# EAGLE design tick-display-mk-3.1 (EAGLE 6.5.0)
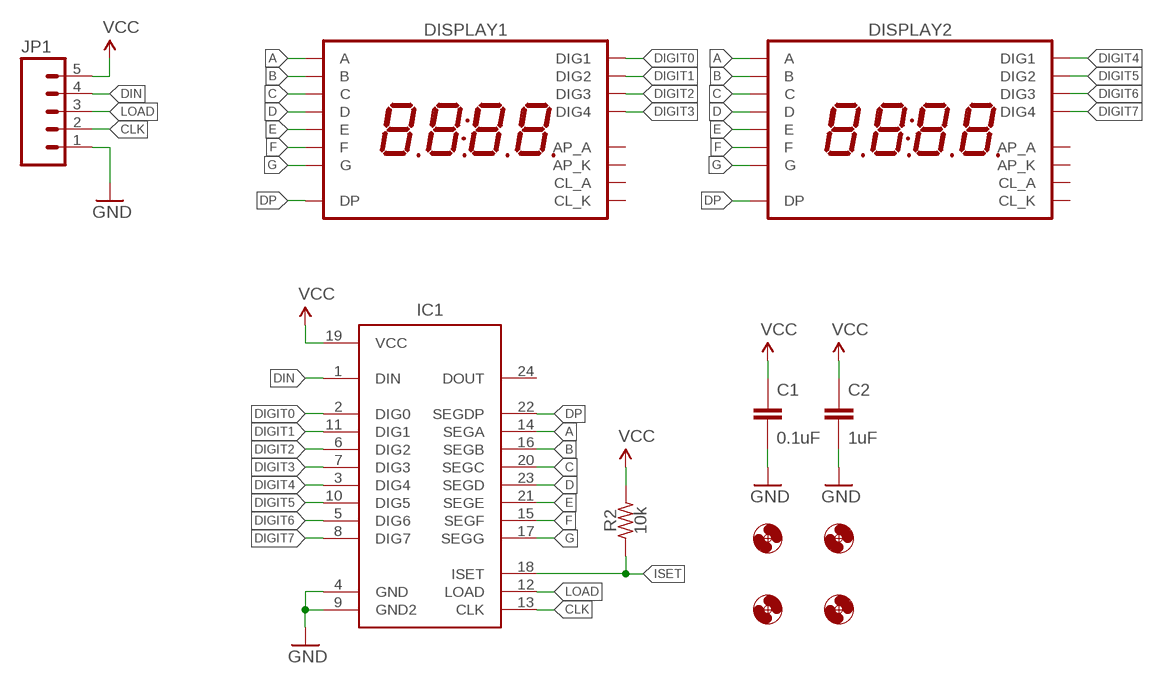
[diagram p0: schematic, sheet 1]

## Parts
C1  0.1uF  CAPACITOR-CERAMIC025-024X044  [C025-024X044]
C2  1uF  CAPACITOR-CERAMIC025-024X044  [C025-024X044]
DISPLAY1  7SEG_4DIGIT_10MM  [7SEG_4DIG_10MM]
DISPLAY2  7SEG_4DIGIT_10MM  [7SEG_4DIG_10MM]
H1  HOLE#2  [HOLE-#2]
H2  HOLE#2  [HOLE-#2]
H3  HOLE#2  [HOLE-#2]
H4  HOLE#2  [HOLE-#2]
IC1  MAX7219CWG  MAX7219SOIC-W  [SO24W]
JP1  M05PTH  [1X05]
R2  10k  RESISTORPTH-AXIAL-5.08MM  [RESISTOR-AXIAL-PTH-5.08MM]

## Nets
A: DISPLAY1.14(A) DISPLAY2.14(A) IC1.14(SEGA)
B: DISPLAY1.16(B) DISPLAY2.16(B) IC1.16(SEGB)
C: DISPLAY1.13(C) DISPLAY2.13(C) IC1.20(SEGC)
CLK: IC1.13(CLK) JP1.2
D: DISPLAY1.3(D) DISPLAY2.3(D) IC1.23(SEGD)
DIGIT0: DISPLAY1.1(DIG1) IC1.2(DIG0)
DIGIT1: DISPLAY1.2(DIG2) IC1.11(DIG1)
DIGIT2: DISPLAY1.6(DIG3) IC1.6(DIG2)
DIGIT3: DISPLAY1.8(DIG4) IC1.7(DIG3)
DIGIT4: DISPLAY2.1(DIG1) IC1.3(DIG4)
DIGIT5: DISPLAY2.2(DIG2) IC1.10(DIG5)
DIGIT6: DISPLAY2.6(DIG3) IC1.5(DIG6)
DIGIT7: DISPLAY2.8(DIG4) IC1.8(DIG7)
DIN: IC1.1(DIN) JP1.4
DP: DISPLAY1.7(DP) DISPLAY2.7(DP) IC1.22(SEGDP)
E: DISPLAY1.5(E) DISPLAY2.5(E) IC1.21(SEGE)
F: DISPLAY1.11(F) DISPLAY2.11(F) IC1.15(SEGF)
G: DISPLAY1.15(G) DISPLAY2.15(G) IC1.17(SEGG)
GND: C1.2 C2.2 IC1.4(GND) IC1.9(GND2) JP1.1
ISET: IC1.18(ISET) R2.P$1
LOAD: IC1.12(LOAD) JP1.3
VCC: C1.1 C2.1 IC1.19(VCC) JP1.5 R2.P$2
Unconnected: DISPLAY1.4(CL_A) DISPLAY1.9(AP_K) DISPLAY1.10(AP_A) DISPLAY1.12(CL_K) DISPLAY2.4(CL_A) DISPLAY2.9(AP_K) DISPLAY2.10(AP_A) DISPLAY2.12(CL_K) IC1.24(DOUT)

## Library data of the parts
C1 C2 = A_butts:CAPACITOR-CERAMIC: CAPACITOR, European symbol
DISPLAY1 DISPLAY2 = A_butts:7SEG_4DIGIT_10MM
H1-H4 = A_butts:HOLE: MOUNTING HOLE with drill center marker
IC1 = A_butts:MAX7219: 8-digit, 8-segment LED display driver, serial input
JP1 = A_butts:M05: Header 5 Standard 5-pin 0.1" header. Use with straight break away headers (SKU : PRT-00116), right angle break away headers (PRT-00553), swiss pins (PRT-00743), machine pins (PRT-00117), and female headers (PRT-00115). Molex polarized connector foot print use with SKU : PRT-08230 with associated crimp pins and housings.
R2 = A_butts:RESISTOR: RESISTOR, American symbol

## Board
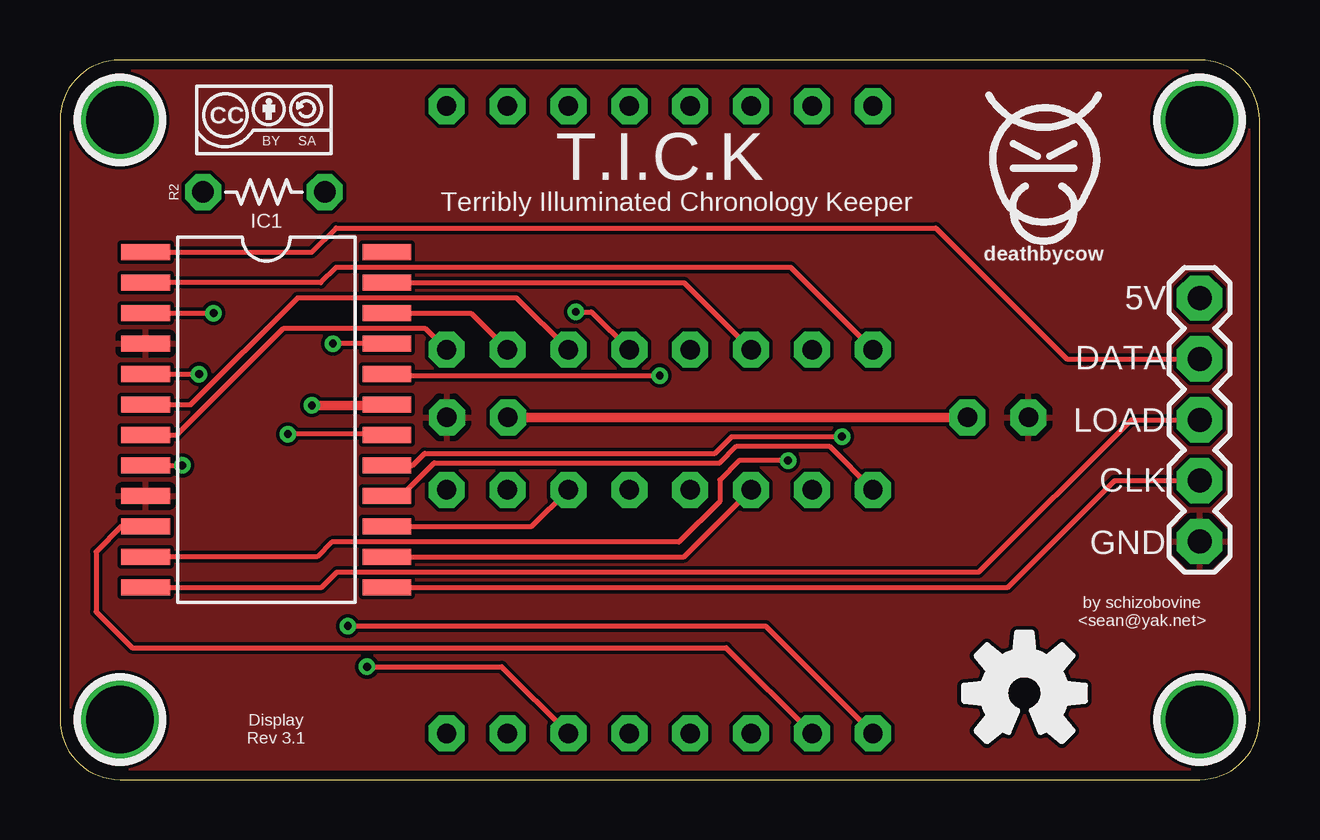
[diagram p1: board, top side]
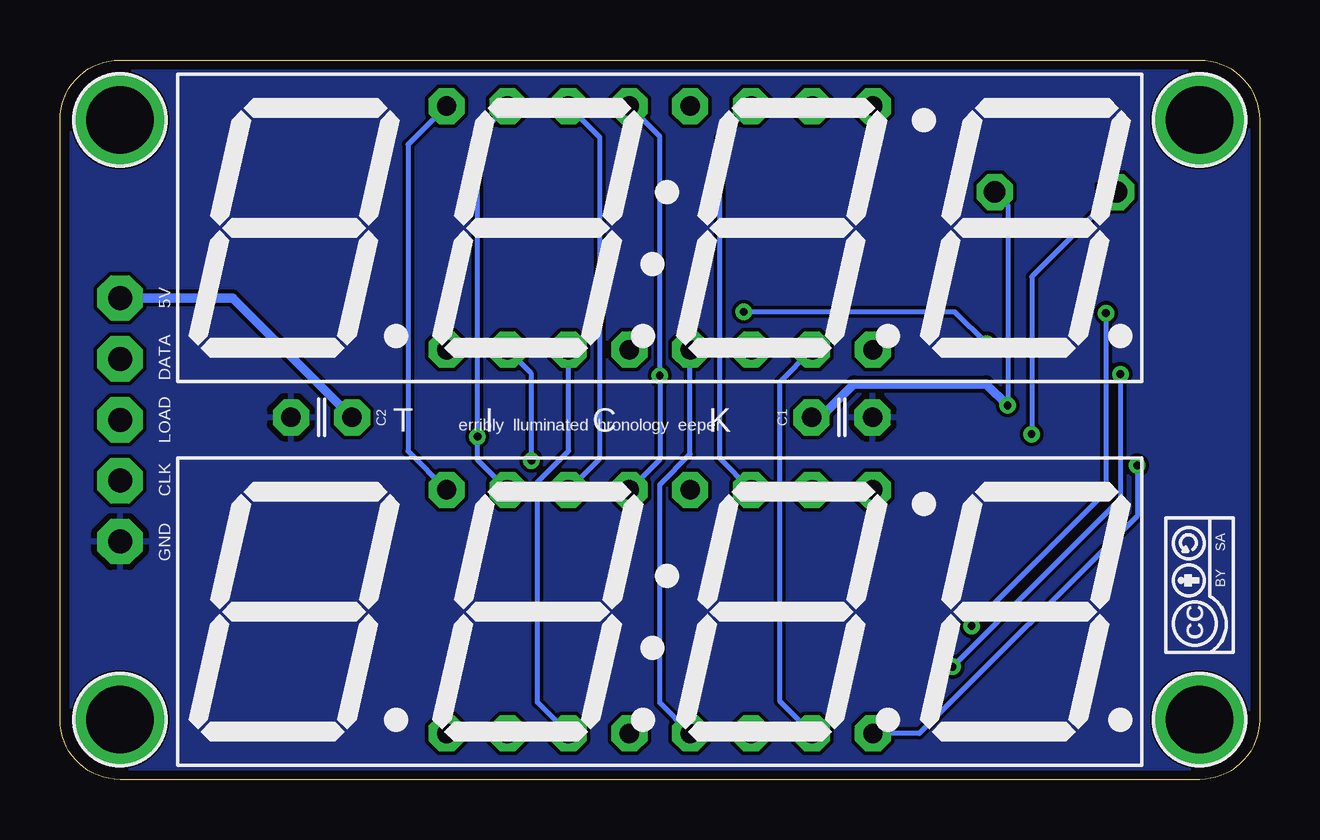
[diagram p2: board, bottom side, seen from below]

Size 50 x 30 mm. Coordinates in mm from the lower left corner, seen from the top.
Outline: 50,2.5 50,27.5 arc90 47.5,30 2.5,30 arc90 0,27.5 0,2.5 arc90 2.5,0 47.5,0 arc90 50,2.5
Copper layers (1*16): Top 0.0356mm / dielectric 1.5011mm / Bottom 0.0356mm
Design rules "LaenPCBOrder2": minimum track width 6mil, minimum drill 13mil, track to track 6mil, track to pad 6mil, pad to pad 6mil, via to via 6mil, smd to smd 6mil, copper to edge 15mil, drill to drill 6mil, minimum pad ring 7mil, minimum via ring 7mil, stop-mask expansion 3mil, vias tented up to drill 20mil, thermal gap 10mil

### Footprints (pad centres in the part's own frame; a part is rotated, then mirrored left to right if it is on the bottom)
C025-024X044 = drill 0.813 pad 1.5 octagon: 1 -1.27,0; 2 1.27,0
7SEG_4DIG_10MM = drill 0.8 pad 1.5 octagon: 1 -8.89,-5.08; 2 -6.35,-5.08; 3 -3.81,-5.08; 4 -1.27,-5.08; 5 1.27,-5.08; 6 3.81,-5.08; 7 6.35,-5.08; 8 8.89,-5.08; 9 8.89,5.08; 10 6.35,5.08; 11 3.81,5.08; 12 1.27,5.08; 13 -1.27,5.08; 14 -3.81,5.08; 15 -6.35,5.08; 16 -8.89,5.08
HOLE-#2 = drill 2.8 pad 3.81: P$1 0,0
SO24W = smd 0.66 x 2.032: 1 -6.985,-5.029; 2 -5.715,-5.029; 3 -4.445,-5.029; 4 -3.175,-5.029; 5 -1.905,-5.029; 6 -0.635,-5.029; 7 0.635,-5.029; 8 1.905,-5.029; 9 3.175,-5.029; 10 4.445,-5.029; 11 5.715,-5.029; 12 6.985,-5.029; 13 6.985,5.029; 14 5.715,5.029; 15 4.445,5.029; 16 3.175,5.029; 17 1.905,5.029; 18 0.635,5.029; 19 -0.635,5.029; 20 -1.905,5.029; 21 -3.175,5.029; 22 -4.445,5.029; 23 -5.715,5.029; 24 -6.985,5.029
1X05 = drill 1 pad 1.88 octagon: 1 0,0; 2 2.54,0; 3 5.08,0; 4 7.62,0; 5 10.16,0
RESISTOR-AXIAL-PTH-5.08MM = drill 0.9 pad 1.5 octagon: P$1 -2.54,0; P$2 2.54,0

### Placement (x,y rotation side)
C1  17.4,15.1 0 bottom
C2  39.1,15.1 180 bottom
DISPLAY1  25,23 0 bottom
DISPLAY2  25,7 0 bottom
H1  2.5,2.5 0 top
H2  2.5,27.5 0 top
H3  47.5,2.5 0 top
H4  47.5,27.5 0 top
IC1  8.6,15 270 top
JP1  47.5,9.92 90 top
R2  8.5,24.5 0 top
U$1  [COW_SMALL]  41,26 0 top
U$2  [CC-BY-SA-4.0-NO-URL]  8.5,27.5 0 top
U$3  [CC-BY-SA-4.0-NO-URL]  2.5,8.1 90 bottom
U$4  [OSHWLOGO_TOP_0.2_A]  40.2,3.6 0 top

### Tracks (layer width: path | path; a pad name or v marks a point on that pad's centre or on a via)
A
  Top 0.2: IC1.14 26.02,9.29 DISPLAY2.14
  Bottom 0.2: DISPLAY2.14 27.5,13.39 27.5,26.77 DISPLAY1.14
B
  Top 0.2: IC1.16 14.22,11.82 15.6,13.2 27.5,13.2 28.2,13.9 32.07,13.9 DISPLAY2.16
  Bottom 0.2: DISPLAY1.16 35.5,26.47 35.5,13.69 DISPLAY2.16
C  (via drill 0.33)
  Top 0.2: v25,16.84 13.09,16.84 IC1.20
  Bottom 0.2: DISPLAY1.13 25,26.81 v25,16.84 25,13.35 DISPLAY2.13
CLK
  Top 0.2: IC1.13 39.52,8.02 43.96,12.46 JP1.2
D
  Top 0.2: IC1.23 26.02,20.71 DISPLAY1.3
  Bottom 0.2: DISPLAY2.3 30.1,3.21 30.1,12.4 28.8,13.7 DISPLAY1.3
DIGIT0
  Top 0.2: DISPLAY1.1 30.46,21.35 11.5,21.35 10.87,20.71 IC1.2
DIGIT1  (via drill 0.33)
  Top 0.2: IC1.11 10.71,9.29 11.33,9.9 25.8,9.9 27.5,11.6 27.5,12.5 28.3,13.3 v30.35,13.3
  Bottom 0.2: v30.35,13.3 30.35,16.92 DISPLAY1.2
DIGIT2
  Top 0.2: DISPLAY1.6 19.03,20.08 9.9,20.08 5.46,15.63 IC1.6
DIGIT3
  Top 0.2: DISPLAY1.8 15.23,18.8 9.3,18.8 4.87,14.37 IC1.7
DIGIT4  (via drill 0.33)
  Top 0.2: IC1.3 v6.4,19.45 | v12,6.4 29.41,6.4 DISPLAY2.1
  Bottom 0.2: v6.4,19.45 6.4,12 v12,6.4
DIGIT5
  Top 0.2: DISPLAY2.2 27.77,5.5 3,5.5 1.5,7 1.5,9.5 2.56,10.55 IC1.10
DIGIT6  (via drill 0.33)
  Top 0.2: IC1.5 v5.8,16.91 | DISPLAY2.6 18.41,4.7 v12.8,4.7
  Bottom 0.2: v5.8,16.91 5.8,11.7 v12.8,4.7
DIGIT7  (via drill 0.33)
  Top 0.2: IC1.8 v5.1,13.1
  Bottom 0.2: v5.1,13.1 5.1,11 14.18,1.92 DISPLAY2.8
DIN
  Top 0.2: IC1.1 10.48,21.98 11.5,23 36.5,23 41.96,17.54 JP1.4
DP
  Top 0.2: IC1.22 17.12,19.45 DISPLAY1.7
  Bottom 0.2: DISPLAY2.7 20,3.27 20,16.57 DISPLAY1.7
E  (via drill 0.33)
  Top 0.2: IC1.21 v11.38,18.18 | v21.5,19.5 22.15,19.5 DISPLAY1.5
  Bottom 0.2: DISPLAY2.5 25,3.19 25,12.3 23.73,13.57 DISPLAY1.5 | v11.38,18.18 12.7,19.5 v21.5,19.5
F
  Top 0.2: IC1.15 19.66,10.55 DISPLAY2.11
  Bottom 0.2: DISPLAY2.11 22.5,13.39 22.5,26.77 DISPLAY1.11
G  (via drill 0.33)
  Top 0.2: IC1.17 14.7,13.1 15.2,13.6 27.3,13.6 28,14.3 v32.6,14.3
  Bottom 0.2: DISPLAY2.15 32.6,13.33 v32.6,14.3 32.6,26.83 DISPLAY1.15
GND
  pour Top: 2.5,30 47.5,30 arc-90 50,27.5 50,2.5 arc-90 47.5,0 2.5,0 arc-90 0,2.5 0,27.5 arc-90
  pour Bottom: 2.5,30 47.5,30 arc-90 50,27.5 50,2.5 arc-90 47.5,0 2.5,0 arc-90 0,2.5 0,27.5 arc-90
ISET  (via drill 0.33)
  Top 0.2: IC1.18 12.99,14.4 v9.5,14.4
  Bottom 0.2: R2.P$1 9.5,20.96 v9.5,14.4
LOAD
  Top 0.2: IC1.12 10.91,8.02 11.55,8.65 38.3,8.65 44.65,15 JP1.3
VCC  (via drill 0.33)
  Top 0.2: 12.99,15.6 IC1.19
  Top 0.4: v10.5,15.6 12.99,15.6 | C1.1 C2.1
  Bottom 0.2: C1.1 18.27,15.13 | R2.P$2 10.5,23.96 v10.5,15.6
  Bottom 0.4: 18.27,15.13 16.9,16.5 11.4,16.5 v10.5,15.6 | C2.1 42.81,20.08 JP1.5

### Text on the board
tPlace: T.I.C.K | Terribly Illuminated Chronology Keeper | 5V | DATA | LOAD | CLK | GND | by schizobovine / <sean@yak.net> | Display / Rev 3.1
bPlace: 5V | DATA | K | C | erribly lluminated hronology eeper | I | T | LOAD | CLK | GND